# EAGLE design pth_supply (EAGLE 6.1)
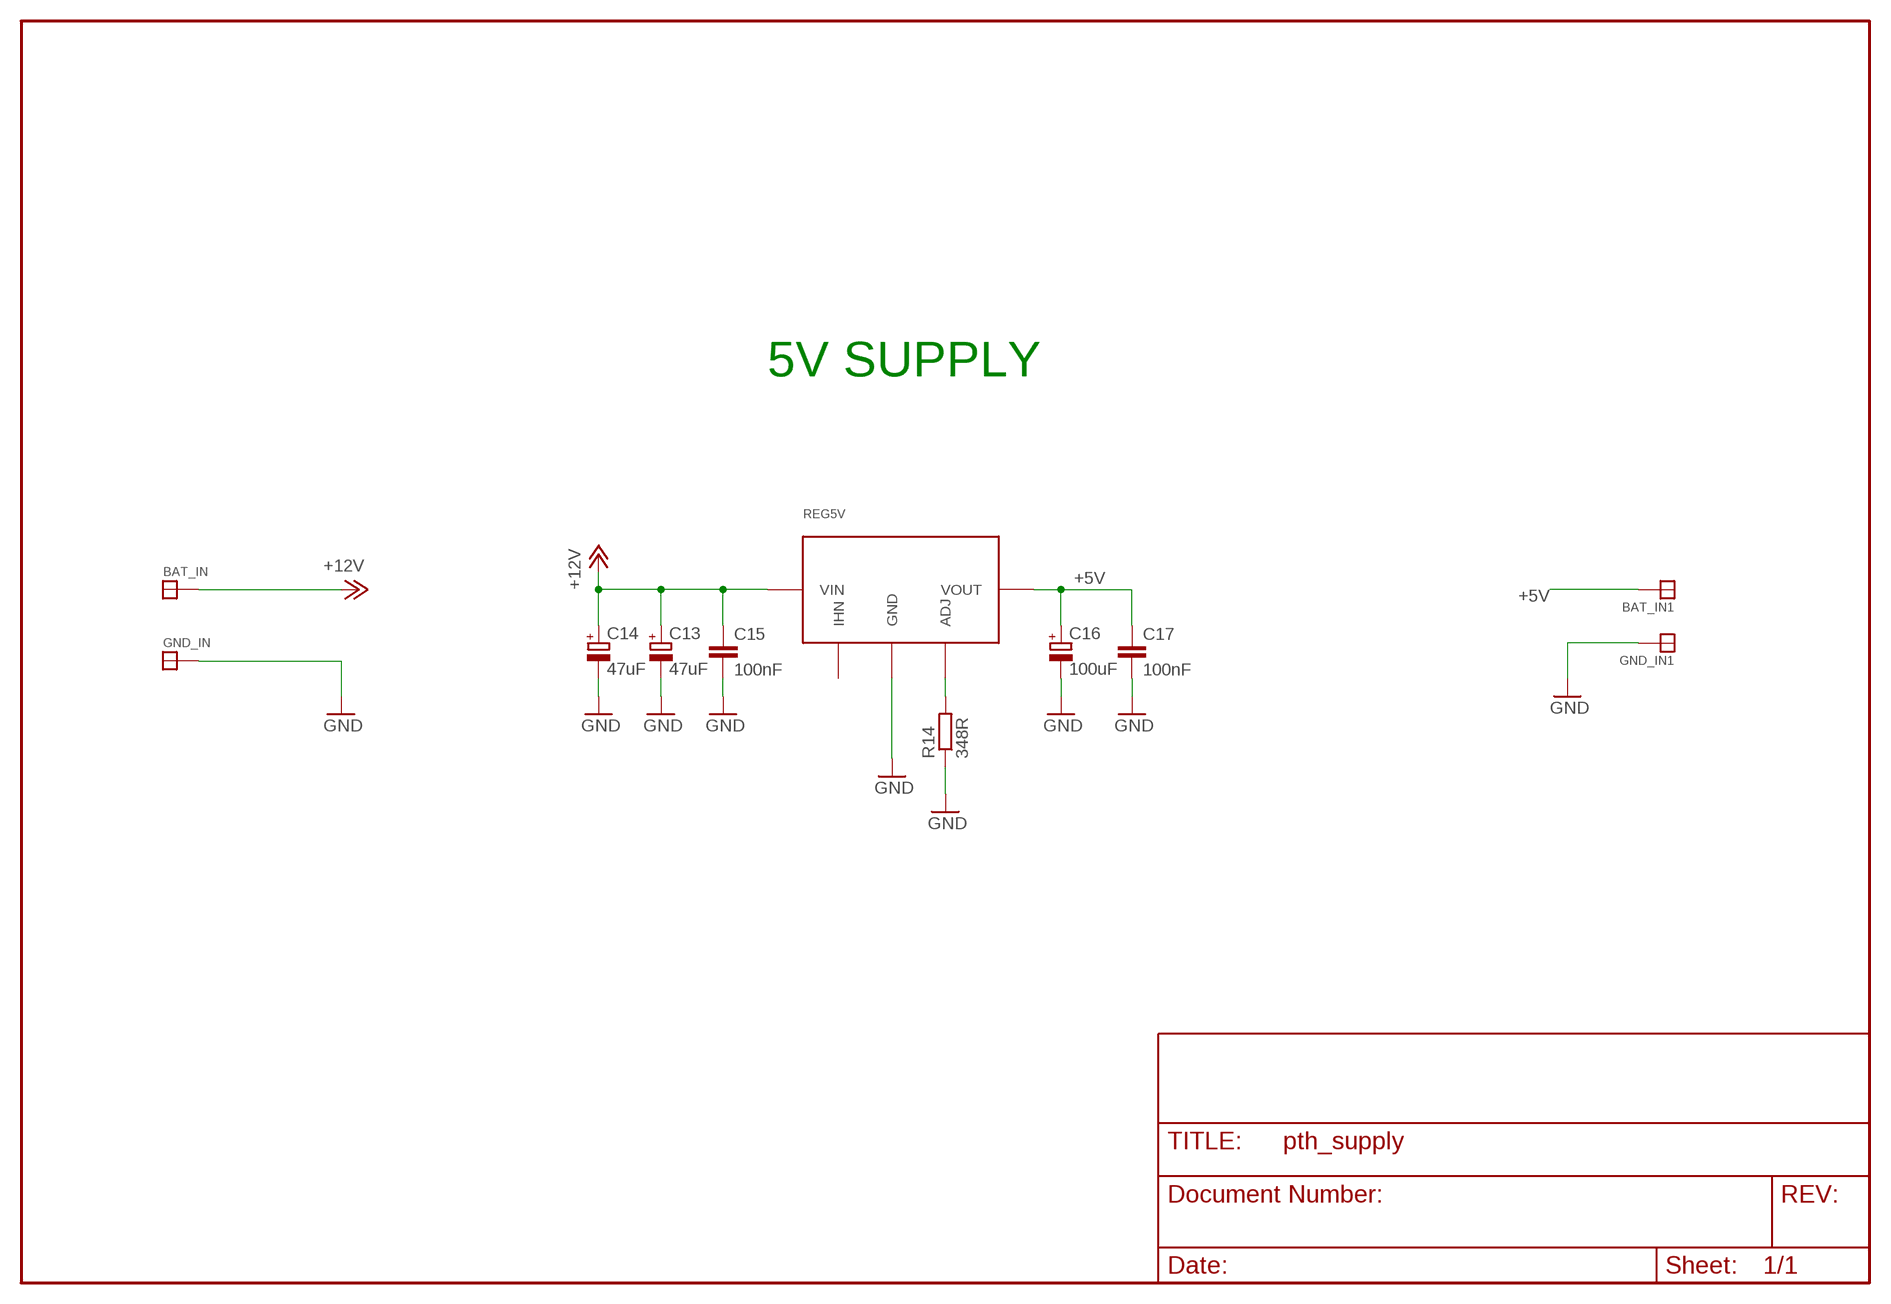
[diagram p0: schematic, sheet 1]

## Parts
BAT_IN  SOLDER_PAD150_75  [SOLD_PAD_150_75]
BAT_IN1  SOLDER_PAD150_75  [SOLD_PAD_150_75]
C13  47uF  CPOL-EUSMCD  [SMC_D]
C14  47uF  CPOL-EUSMCD  [SMC_D]
C15  100nF  C-EUC0805K  [C0805K]
C16  100uF  CPOL-EUSMCD  [SMC_D]
C17  100nF  C-EUC0805K  [C0805K]
GND_IN  SOLDER_PAD150_75  [SOLD_PAD_150_75]
GND_IN1  SOLDER_PAD150_75  [SOLD_PAD_150_75]
R14  348R  R-EU_R1206  [R1206]
REG5V  PTH  [PTH]

## Nets
+5V: BAT_IN1.P$1 C16.+ C17.1 REG5V.P$3(VOUT)
+12V: BAT_IN.P$1 C13.+ C14.+ C15.1 REG5V.P$1(VIN)
GND: C13.- C14.- C15.2 C16.- C17.2 GND_IN1.P$1 GND_IN.P$1 R14.1 REG5V.P$2(GND)
N$5: R14.2 REG5V.P$4(ADJ)
Unconnected: REG5V.P$5(IHN)

## Notes on the sheet
- 5V SUPPLY

## Library data of the parts
BAT_IN BAT_IN1 GND_IN GND_IN1 = paparazzi:SOLDER_PAD
C13 C14 C16 = rcl:CPOL-EU: POLARIZED CAPACITOR, European symbol
C15 C17 = rcl:C-EU: CAPACITOR, European symbol
R14 = rcl:R-EU_: RESISTOR, European symbol
REG5V = paparazzi:PTH

## Board
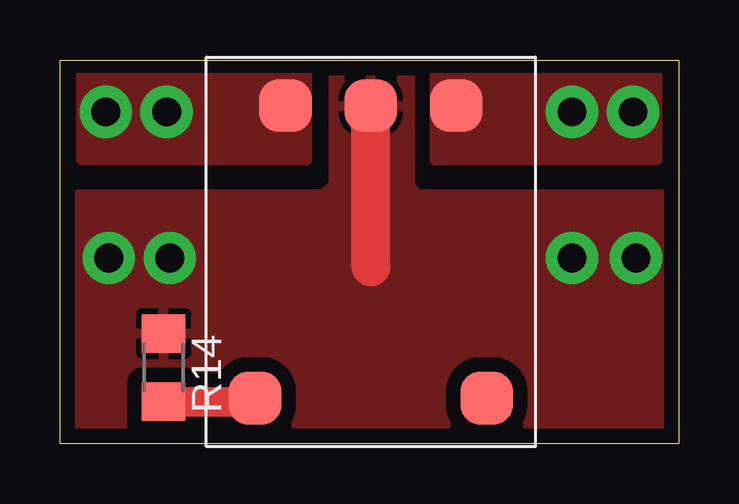
[diagram p1: board, top side]
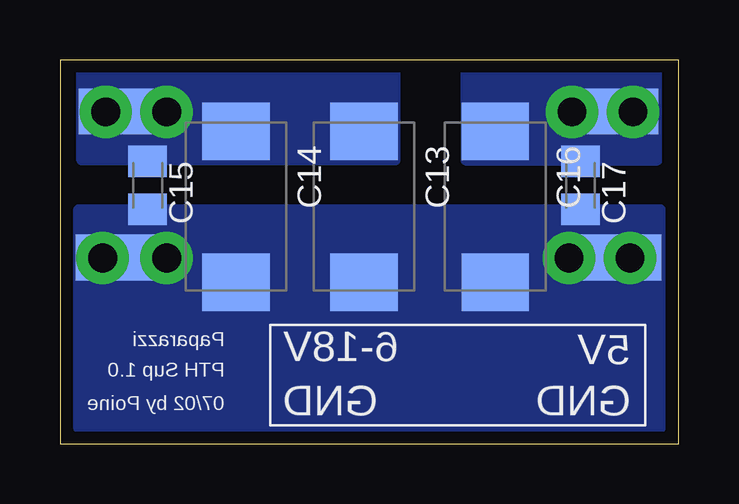
[diagram p2: board, bottom side, seen from below]

Size 25.78 x 16 mm. Coordinates in mm from the lower left corner, seen from the top.
Outline: 0,0 0,16 25.78,16 25.78,0 0,0
Copper layers (1*16): Top 0.035mm / dielectric 1.5mm / Bottom 0.035mm
Design rules: minimum track width 10mil, minimum drill 19mil, track to track 8mil, track to pad 8mil, pad to pad 8mil, via to via 8mil, smd to smd 8mil, copper to edge 20mil, drill to drill 8mil, minimum pad ring 10mil, minimum via ring 8mil, stop-mask expansion 4mil, vias tented up to drill 0mil, thermal gap 10mil

### Footprints (pad centres in the part's own frame; a part is rotated, then mirrored left to right if it is on the bottom)
SOLD_PAD_150_75 = smd 3.81 x 1.905: P$1 0,0
SMC_D = smd 2.4 x 2.8: + -3.15,0; - 3.15,0
C0805K = smd 1.3 x 1.6: 1 -1,0; 2 1,0
R1206 = smd 1.6 x 1.803: 1 -1.422,0; 2 1.422,0
PTH = smd 2.184 x 2.184: P$1 -6.096,3.556; P$2 -6.096,0; P$3 -6.096,-3.556; P$4 6.096,-4.826; P$5 6.096,4.826

### Placement (x,y rotation side)
BAT_IN  23.08,13.86 0 bottom
BAT_IN1  2.76,13.86 0 bottom
C13  13.11,9.89 270 bottom
C14  18.44,9.89 270 bottom
C15  22.13,10.77 270 bottom
C16  7.65,9.89 270 bottom
C17  4.09,10.77 270 bottom
GND_IN  2.64,7.77 0 bottom
GND_IN1  23.21,7.77 0 bottom
R14  4.32,3.17 270 top
REG5V  12.95,8 270 top

### Tracks (layer width: path | path; a pad name or v marks a point on that pad's centre or on a via)
+5V  (via drill 1.2 pad 2.18)
  other vias: 1.91,13.84 4.44,13.84
  pour Bottom (no thermals): 0.89,16.64 8.89,16.64 8.89,11.81 0.89,11.81
  pour Top (no thermals): 0.89,16.64 10.29,16.64 10.29,11.81 0.89,11.81
+12V  (via drill 1.2 pad 2.18)
  other vias: 21.34,13.84 23.88,13.84
  pour Bottom (no thermals): 24.89,16.64 11.81,16.64 11.81,11.81 24.89,11.81
  pour Top (no thermals): 15.62,16.64 24.89,16.64 24.89,11.81 15.62,11.81
GND  (via drill 1.2 pad 2.18)
  Top 1.626: 12.95,7.39 REG5V.P$2
  other vias: 21.34,7.75 24,7.75 2.03,7.75 4.57,7.75
  pour Top (isolate 0.61): 11.4,16.78 14.58,16.78 14.58,10.82 14.86,10.41 25.15,10.41 25.15,-1.14 0.76,-1.14 0.76,10.41 10.92,10.41 11.4,10.82
  pour Bottom (no thermals): 25.02,9.78 0.76,9.78 0.76,0.64 25.02,0.64
N$5
  Top 1.219: R14.2 8.13,1.75 REG5V.P$4

### Text on the board
bPlace: Paparazzi | 5V | 6-18V | PTH Sup 1.0 | GND | GND | 07/02 by Poine